# EAGLE schematic Schematic (EAGLE 9.7.0)
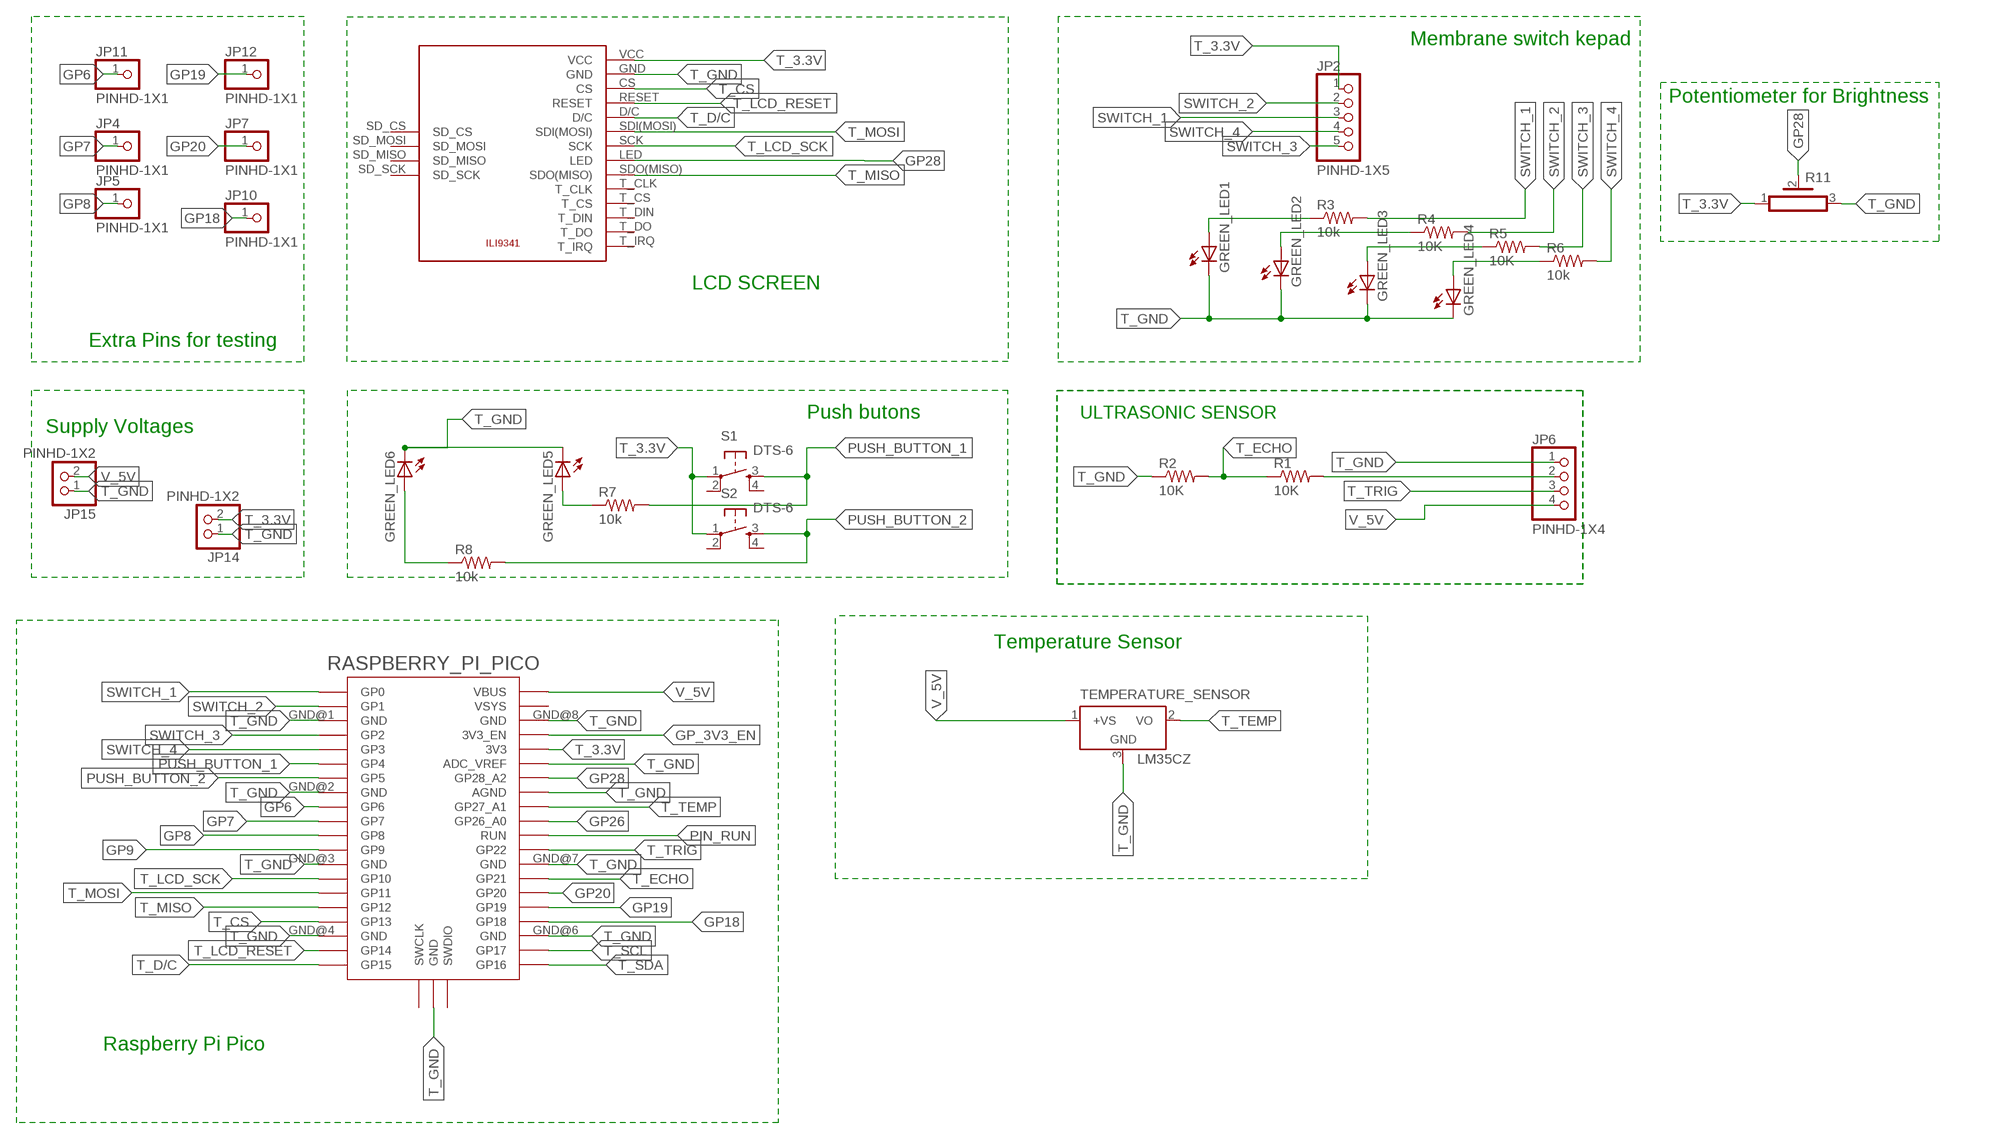
[diagram p0: schematic, sheet 1]

## Parts
GREEN_LED1  3MM_LED_TH  [LED3MM]
GREEN_LED2  3MM_LED_TH  [LED3MM]
GREEN_LED3  3MM_LED_TH  [LED3MM]
GREEN_LED4  3MM_LED_TH  [LED3MM]
GREEN_LED5  3MM_LED_TH  [LED3MM]
GREEN_LED6  3MM_LED_TH  [LED3MM]
JP2  PINHD-1X5  [1X05]
JP4  PINHD-1X1  [1X01]
JP5  PINHD-1X1  [1X01]
JP6  PINHD-1X4  [1X04]
JP7  PINHD-1X1  [1X01]
JP10  PINHD-1X1  [1X01]
JP11  PINHD-1X1  [1X01]
JP12  PINHD-1X1  [1X01]
JP14  PINHD-1X2  [1X02]
JP15  PINHD-1X2  [1X02]
LCD_SCREEN  ILI9341  [ILI9341]
R1  10K  RESISTOR_1/4W_0207/10  [0207/10]
R2  10K  RESISTOR_1/4W_0207/10  [0207/10]
R3  10k  RESISTOR_1/4W_0207/10  [0207/10]
R4  10K  RESISTOR_1/4W_0207/10  [0207/10]
R5  10K  RESISTOR_1/4W_0207/10  [0207/10]
R6  10k  RESISTOR_1/4W_0207/10  [0207/10]
R7  10k  RESISTOR_1/4W_0207/10  [0207/10]
R8  10k  RESISTOR_1/4W_0207/10  [0207/10]
R11  PV36Y  [PV36Y]
RASPBERRY_PI_PICO  RPI_PICO_IG-TH  [RPI_PICO_TH]
S1  DTS-6  [DTS-6]
S2  DTS-6  [DTS-6]
TEMPERATURE_SENSOR  LM35CZ  [TO92]

## Nets
GP6: JP11.1 RASPBERRY_PI_PICO.GP6
GP7: JP4.1 RASPBERRY_PI_PICO.GP7
GP8: JP5.1 RASPBERRY_PI_PICO.GP8
GP9: RASPBERRY_PI_PICO.GP9
GP18: JP10.1 RASPBERRY_PI_PICO.GP18
GP19: JP12.1 RASPBERRY_PI_PICO.GP19
GP20: JP7.1 RASPBERRY_PI_PICO.GP20
GP26: RASPBERRY_PI_PICO.GP26_A0
GP28: LCD_SCREEN.LED R11.2 RASPBERRY_PI_PICO.GP28_A2
GP_3V3_EN: RASPBERRY_PI_PICO.3V3_EN
N$2: JP6.2 R1.2
N$5: GREEN_LED4.A R6.1
N$7: GREEN_LED3.A R5.1
N$9: GREEN_LED2.A R4.1
N$10: GREEN_LED1.A R3.1
N$12: GREEN_LED5.A R7.1
N$23: GREEN_LED6.A R8.1
PIN_RUN: RASPBERRY_PI_PICO.RUN
PUSH_BUTTON_1: R7.2 RASPBERRY_PI_PICO.GP4 S1.3
PUSH_BUTTON_2: R8.2 RASPBERRY_PI_PICO.GP5 S2.3
SWITCH_1: JP2.3 R3.2 RASPBERRY_PI_PICO.GP0
SWITCH_2: JP2.2 R4.2 RASPBERRY_PI_PICO.GP1
SWITCH_3: JP2.5 R5.2 RASPBERRY_PI_PICO.GP2
SWITCH_4: JP2.4 R6.2 RASPBERRY_PI_PICO.GP3
T_3.3V: JP2.1 JP14.2 LCD_SCREEN.VCC R11.1 RASPBERRY_PI_PICO.3V3 S1.1 S2.1
T_CS: LCD_SCREEN.CS RASPBERRY_PI_PICO.GP13
T_D/C: LCD_SCREEN.D/C RASPBERRY_PI_PICO.GP15
T_ECHO: R1.1 R2.2 RASPBERRY_PI_PICO.GP21
T_GND: GREEN_LED1.K(C) GREEN_LED2.K(C) GREEN_LED3.K(C) GREEN_LED4.K(C) GREEN_LED5.K(C) GREEN_LED6.K(C) JP6.1 JP14.1 JP15.1 LCD_SCREEN.GND R2.1 R11.3 RASPBERRY_PI_PICO.ADC_VREF RASPBERRY_PI_PICO.AGND RASPBERRY_PI_PICO.GND@1(GND) RASPBERRY_PI_PICO.GND@2(GND) RASPBERRY_PI_PICO.GND@3(GND) RASPBERRY_PI_PICO.GND@4(GND) RASPBERRY_PI_PICO.GND@5(GND) RASPBERRY_PI_PICO.GND@6(GND) RASPBERRY_PI_PICO.GND@7(GND) RASPBERRY_PI_PICO.GND@8(GND) TEMPERATURE_SENSOR.3(GND)
T_LCD_RESET: LCD_SCREEN.RESET RASPBERRY_PI_PICO.GP14
T_LCD_SCK: LCD_SCREEN.SCK RASPBERRY_PI_PICO.GP10
T_MISO: LCD_SCREEN.SDO(MISO) RASPBERRY_PI_PICO.GP12
T_MOSI: LCD_SCREEN.SDI(MOSI) RASPBERRY_PI_PICO.GP11
T_SCL: RASPBERRY_PI_PICO.GP17
T_SDA: RASPBERRY_PI_PICO.GP16
T_TEMP: RASPBERRY_PI_PICO.GP27_A1 TEMPERATURE_SENSOR.2(VO)
T_TRIG: JP6.3 RASPBERRY_PI_PICO.GP22
V_5V: JP6.4 JP15.2 RASPBERRY_PI_PICO.VBUS TEMPERATURE_SENSOR.1(+VS)
Unconnected: LCD_SCREEN.SD_CS LCD_SCREEN.SD_MISO LCD_SCREEN.SD_MOSI LCD_SCREEN.SD_SCK LCD_SCREEN.T_CLK LCD_SCREEN.T_CS LCD_SCREEN.T_DIN LCD_SCREEN.T_DO LCD_SCREEN.T_IRQ RASPBERRY_PI_PICO.SWCLK RASPBERRY_PI_PICO.SWDIO RASPBERRY_PI_PICO.VSYS S1.2 S1.4 S2.2 S2.4

## Notes on the sheet
- Membrane switch kepad
- Potentiometer for Brightness
- LCD SCREEN
- Extra Pins for testing
- Push butons | ULTRASONIC SENSOR
- Supply Voltages
- Temperature Sensor
- Raspberry Pi Pico

## Library data of the parts
GREEN_LED1-GREEN_LED6 = BASIC_Components:3MM_LED_TH
JP2 = Connector:PINHD-1X5: PIN HEADER; CATEGORY: CONNECTOR; SUB-CATEGORY: PIN-HEADER
JP4 JP5 JP7 JP10-JP12 = Connector:PINHD-1X1: PIN HEADER; CATEGORY: CONNECTOR; SUB-CATEGORY: PIN-HEADER
JP6 = Connector:PINHD-1X4: PIN HEADER; CATEGORY: CONNECTOR; SUB-CATEGORY: PIN-HEADER
JP14 JP15 = Connector:PINHD-1X2: PIN HEADER; CATEGORY: CONNECTOR; SUB-CATEGORY: PIN-HEADER
LCD_SCREEN = ILI9341:ILI9341
R1-R8 = BASIC_Components:RESISTOR_1/4W_0207/10
R11 = Resistor:PV36: Rectangular Trimmer Potentiometers - PV36 Series Datasheet <https://www.bourns.com/docs/Product-Datasheets/pv36.pdf>; CATEGORY: Resistor; DESCRIPTION: Lead Sealed Type Multiturn PV36 Series; MANUFACTURER: BOURNS; MPN: PV36Y; OPERATING_TEMPERATURE: -55 to +125 °C; PART_STATUS: Active; ROHS_COMPLIANCE: ROHS Compliant; SERIES: PV36; SUB-CATEGORY: Trimpot; TYPE: Lead Sealed
RASPBERRY_PI_PICO = RaspberryPi_Pico:RPI_PICO_IG
S1 S2 = switch-tact:DTS-6
TEMPERATURE_SENSOR = lm35:LM35: Single-Supply Centigrade Temperature Sensor Vout = (10mV/°C x Temp °C) +5mmmV Source: http://www.national.com/ds/LM/LM35.pdf